# EAGLE design board5 (EAGLE 6.4)
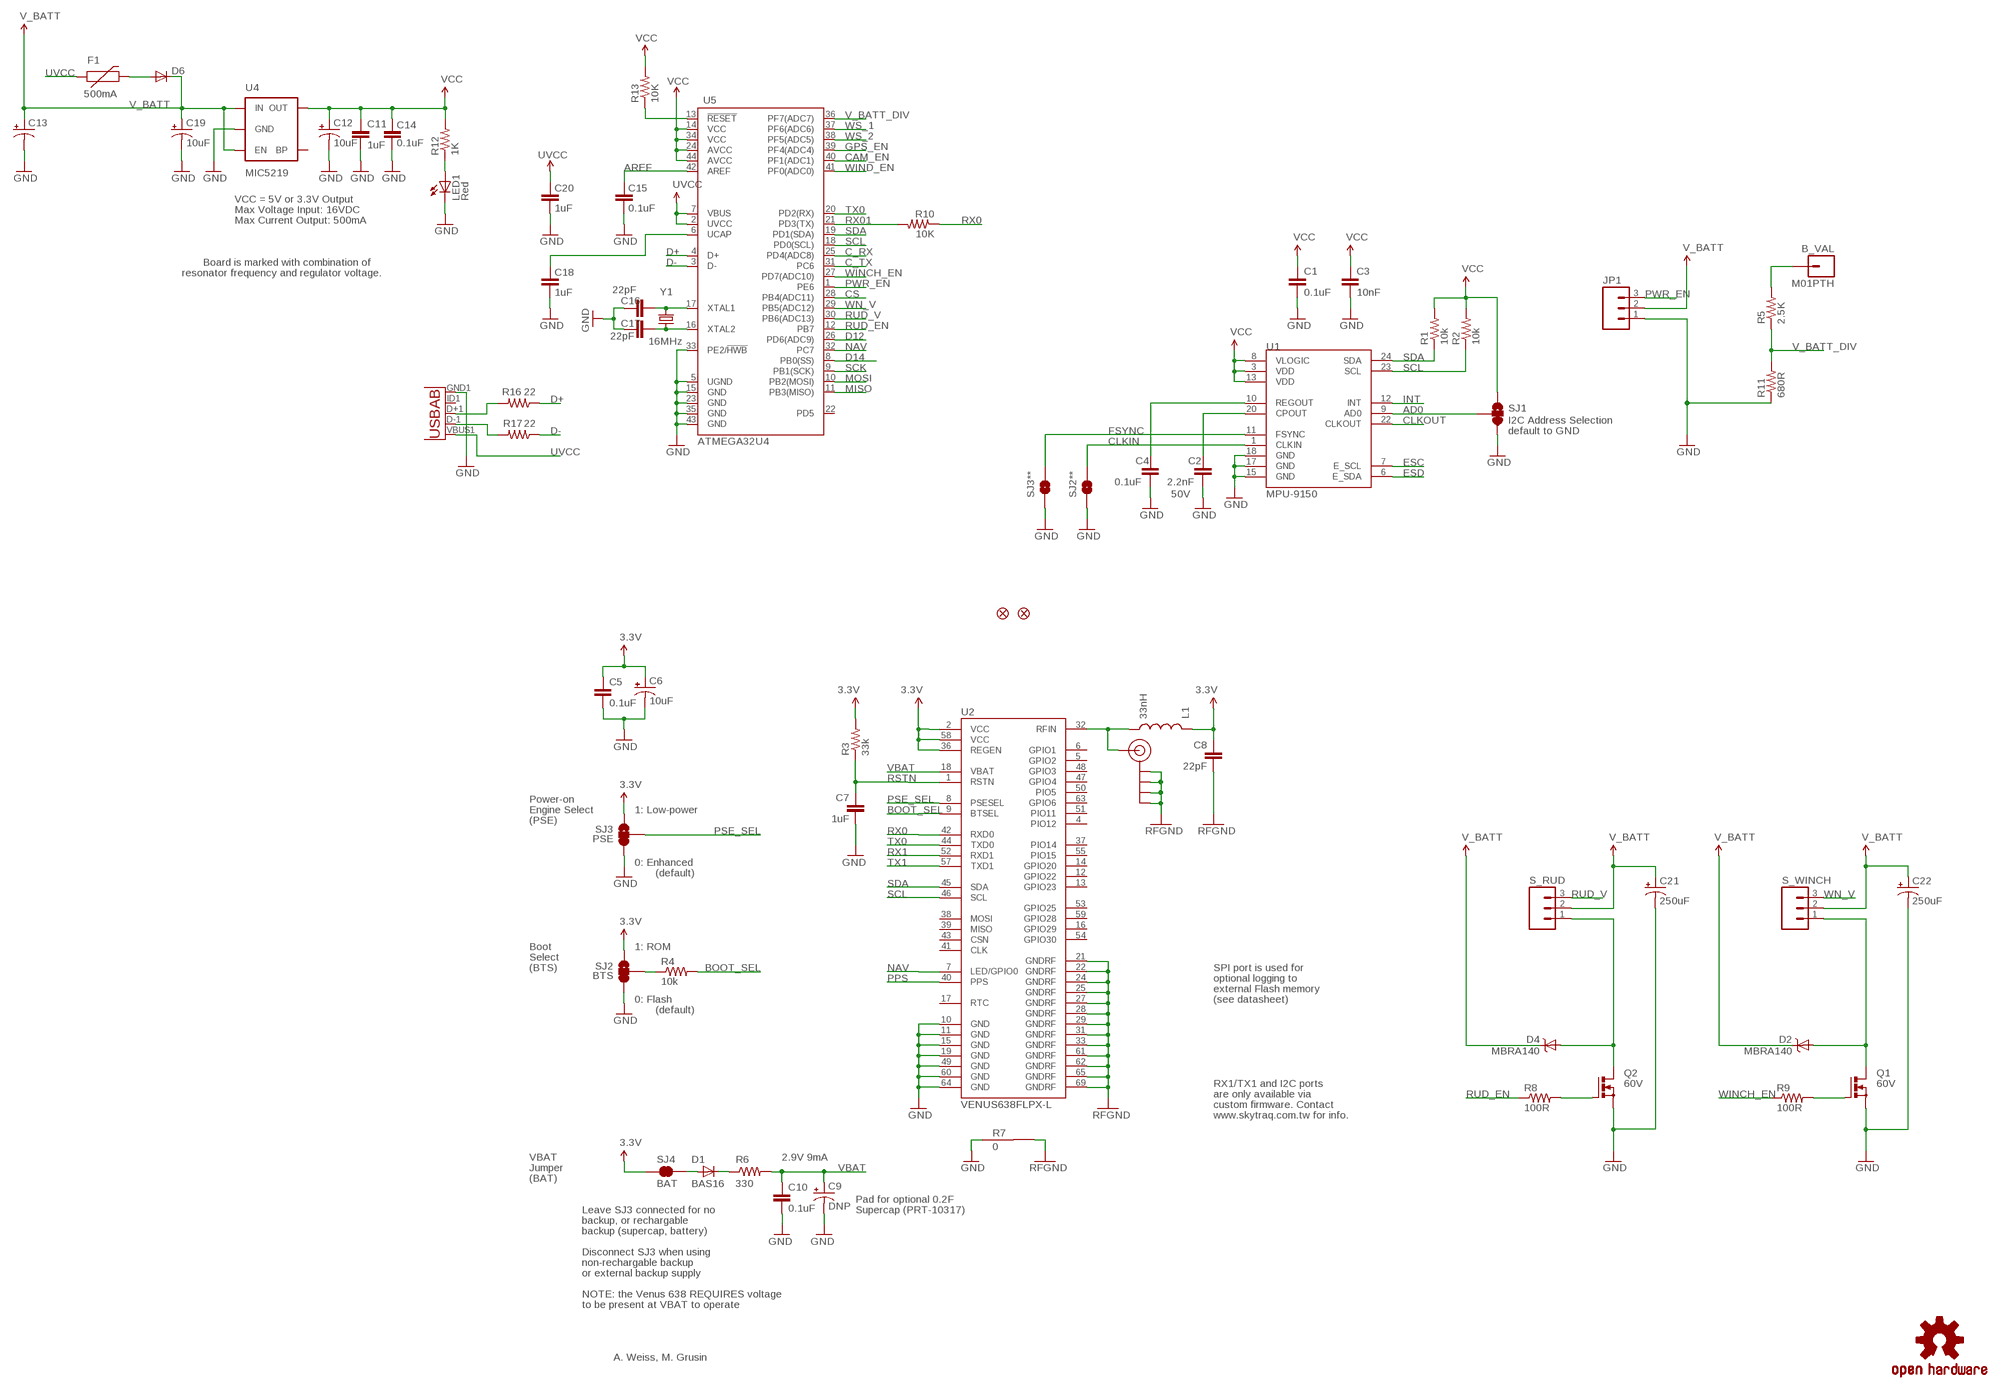
[diagram p0: schematic, sheet 1, part 1 of 2]
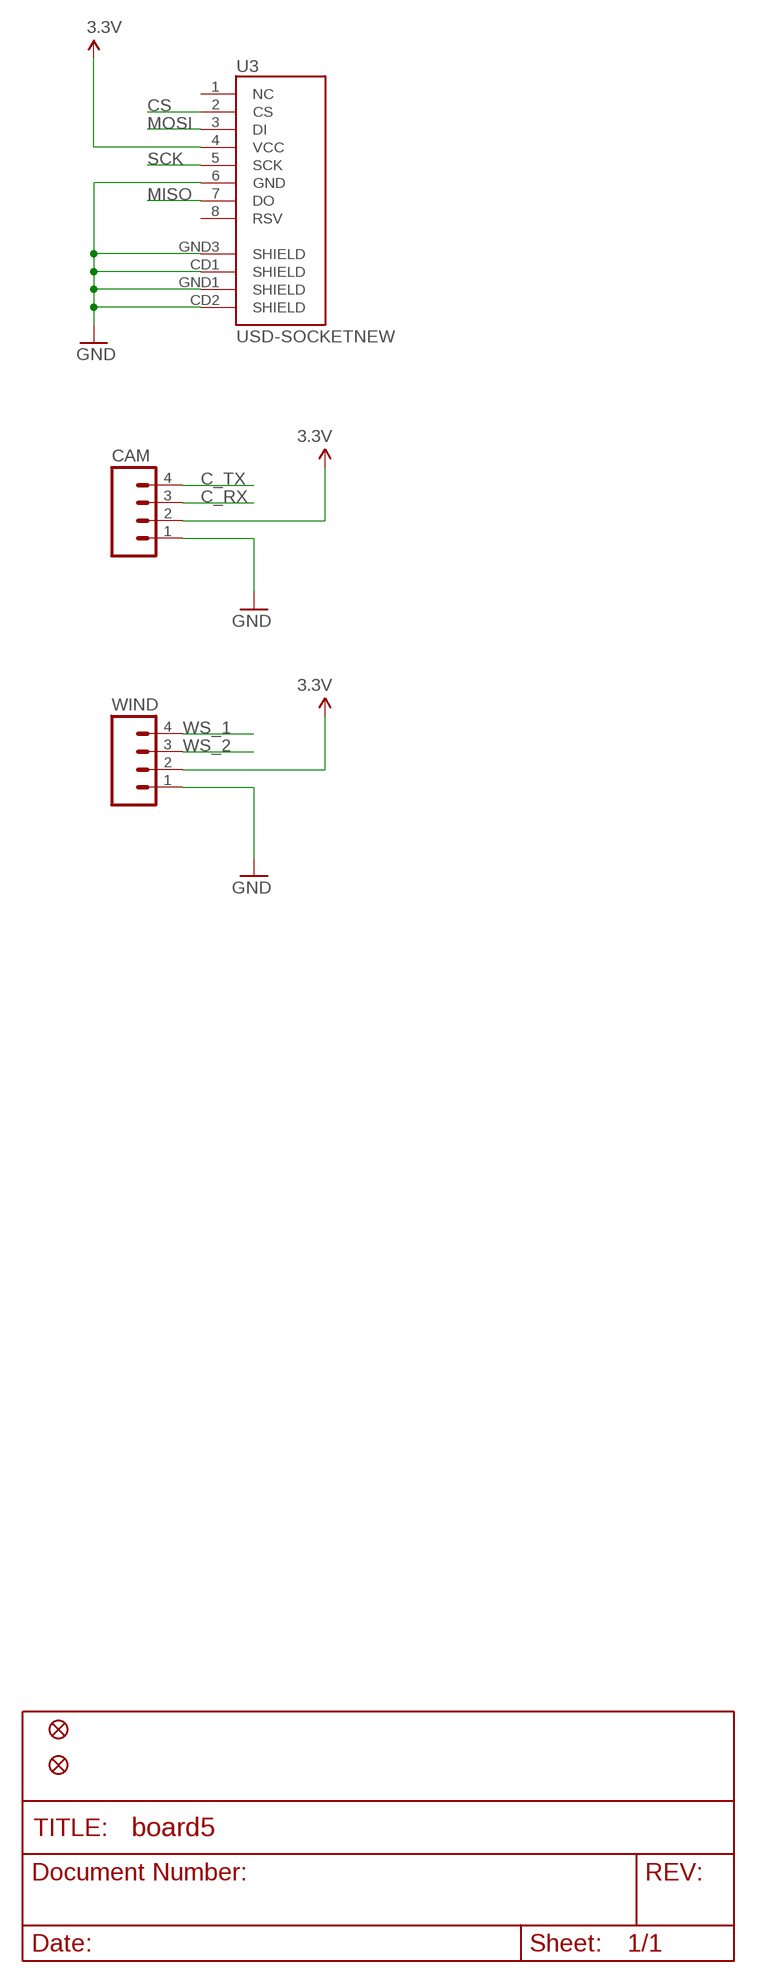
[diagram p1: schematic, sheet 1, part 2 of 2]

## Parts
B_VAL  M01PTH  [1X01]
C1  0.1uF  CAP0402-CAP  [0402-CAP]
C2  2.2nF  CAP0402-CAP  [0402-CAP]
C3  10nF  CAP0402-CAP  [0402-CAP]
C4  0.1uF  CAP0402-CAP  [0402-CAP]
C5  0.1uF  CAP0402-CAP  [0402-CAP]
C6  10uF  CAP_POL1206  [EIA3216]
C7  1uF  CAP0402-CAP  [0402-CAP]
C8  22pF  CAP0402-CAP  [0402-CAP]
C9  DNP  CAP_POLPTH4  [CPOL-RADIAL-1000UF-25V]
C10  0.1uF  CAP0402-CAP  [0402-CAP]
C11  1uF  CAP0603-CAP  [0603-CAP]
C12  10uF  CAP_POL1206  [EIA3216]
C13  CAP_POLPTH4  [CPOL-RADIAL-1000UF-25V]
C14  0.1uF  CAP0603-CAP  [0603-CAP]
C15  0.1uF  CAP0603-CAP  [0603-CAP]
C16  22pF  CAP0603-CAP  [0603-CAP]
C17  22pF  CAP0603-CAP  [0603-CAP]
C18  1uF  CAP0603-CAP  [0603-CAP]
C19  10uF  CAP_POL1206  [EIA3216]
C20  1uF  CAP0603-CAP  [0603-CAP]
C21  250uF  CAP_POLPTH4  [CPOL-RADIAL-1000UF-25V]
C22  250uF  CAP_POLPTH4  [CPOL-RADIAL-1000UF-25V]
CAM  M04PTH  [1X04]
D1  BAS16  DIODESOD  [SOD-323]
D2  MBRA140  [SMA-DIODE]
D4  MBRA140  [SMA-DIODE]
D6  DIODESOD  [SOD-323]
F1  500mA  PTCSMD  [PTC-1206]
JP1  M03SCREW  [SCREWTERMINAL-3.5MM-3]
JP3  FIDUCIALUFIDUCIAL  [MICRO-FIDUCIAL]
JP4  FIDUCIALUFIDUCIAL  [MICRO-FIDUCIAL]
JP5  SMA_EDGE  [SMA-EDGE]
JP7  FIDUCIALUFIDUCIAL  [MICRO-FIDUCIAL]
JP8  FIDUCIALUFIDUCIAL  [MICRO-FIDUCIAL]
L1  33nH  INDUCTOR0402  [C0402]
LED1  Red  LED0603  [LED-0603]
Q1  60V  PMOSFET_NTO220BV  [TO220BV]
Q2  60V  PMOSFET_NTO220BV  [TO220BV]
R1  10k  RESISTOR0603-RES  [0603-RES]
R2  10k  RESISTOR0603-RES  [0603-RES]
R3  33k  RESISTOR0402-RES  [0402-RES]
R4  10k  RESISTOR0402-RES  [0402-RES]
R5  2.5K  RESISTOR0603-RES  [0603-RES]
R6  330  RESISTOR0402-RES  [0402-RES]
R7  0  GND-JUMP  [GND-JUMP]
R8  100R  RESISTOR0603  [0603-RES]
R9  100R  RESISTOR0603  [0603-RES]
R10  10K  RESISTOR0402-RES  [0402-RES]
R11  680R  RESISTOR0603-RES  [0603-RES]
R12  1K  RESISTOR0603-RES  [0603-RES]
R13  10K  RESISTOR0603-RES  [0603-RES]
R16  22  RESISTOR0603-RES  [0603-RES]
R17  22  RESISTOR0603-RES  [0603-RES]
S_RUD  M03PTH  [1X03]
S_WINCH  M03PTH  [1X03]
SJ1  SOLDERJUMPER_2WAYPASTE2&3  [SJ_3_PASTE2&3]
SJ2  BTS  SOLDERJUMPER_2WAYPASTE2&3  [SJ_3_PASTE2&3]
SJ2**  SOLDERJUMPERTRACE  [SJ_2S-TRACE]
SJ3  PSE  SOLDERJUMPER_2WAYPASTE2&3  [SJ_3_PASTE2&3]
SJ3**  SOLDERJUMPERTRACE  [SJ_2S-TRACE]
SJ4  BAT  SOLDERJUMPERNC  [SJ_2S]
U1  MPU-9150  MPU-9150QFN-24-NP  [QFN-24-NP]
U2  VENUS638FLPX-L  [VENUS638FLPX]
U3  USD-SOCKETNEW  [MICRO-SD-SOCKET-PP]
U4  MIC5219  V_REG_LDOSMD  [SOT23-5]
U5  ATMEGA32U4  ATMEGA32U4OUTFAKES  [QFN-44-NOPAD_1:1-OUTFAKES]
U$4  OSHW-LOGOS  [OSHW-LOGO-S]
WIND  M04PTH  [1X04]
X1  USB-ABIN&OUT  [USB-AB-MICRO-SMD-V03-IN&OUT]
Y1  16MHz  CRYSTAL5X3  [CRYSTAL-SMD-5X3]

## Nets
3.3V: C1.1 C3.1 C11.1 C12.A(+) C14.2 R1.2 R2.2 R12.2 R13.2 SJ1.1 U1.3(VDD) U1.8(VLOGIC) U1.13(VDD) U3.4(VCC) U4.5(OUT) U5.14(VCC) U5.24(AVCC) U5.34(VCC) U5.44(AVCC) ; supply symbol labelled VCC
AD0: SJ1.2 U1.9(AD0)
ANT: JP5.SIG(SIGNAL) L1.2 U2.32(RFIN)
AREF: C15.2 U5.42(AREF)
BOOT_SEL: R4.2 U2.9(BTSEL)
C_RX: CAM.3 U5.25(PD4(ADC8))
C_TX: CAM.4 U5.31(PC6)
CAM_EN: CAM.2 U5.40(PF1(ADC1)) ; supply symbol labelled 3.3V
CLKIN: SJ2**.2 U1.1(CLKIN)
CLKOUT: U1.22(CLKOUT)
CS: U3.2(CS) U5.28(PB4(ADC11))
D12: U5.26(PD6(ADC9))
D14: U5.8(PB0(SS))
D+: R16.1 U5.4(D+)
D-: R17.1 U5.3(D-)
ESC: U1.7(E_SCL)
ESD: U1.6(E_SDA)
FSYNC: SJ3**.2 U1.11(FSYNC)
GND: C1.2 C2.2 C3.2 C4.2 C5.2 C6.C(-) C7.2 C9.2(-) C10.2 C11.2 C12.C(-) C13.2(-) C14.1 C15.1 C16.2 C17.2 C18.1 C19.C(-) C20.1 C21.2(-) C22.2(-) CAM.1 JP1.1 LED1.C Q1.S Q2.S R7.1 R11.1 SJ1.3 SJ2**.1 SJ2.3 SJ3**.1 SJ3.3 U1.15(GND) U1.17(GND) U1.18(GND) U2.10(GND) U2.11(GND) U2.15(GND) U2.19(GND) U2.49(GND) U2.60(GND) U2.64(GND) U3.6(GND) U3.CD1(SHIELD) U3.CD2(SHIELD) U3.GND1(SHIELD) U3.GND3(SHIELD) U4.2(GND) U5.5(UGND) U5.15(GND) U5.23(GND) U5.33(PE2/!HWB) U5.35(GND) U5.43(GND) WIND.1 X1.GND1(GND)
GPS_EN: C5.1 C6.A(+) C8.1 L1.1 R3.2 SJ2.1 SJ3.1 SJ4.1 U2.2(VCC) U2.36(REGEN) U2.58(VCC) U5.39(PF4(ADC4)) ; supply symbol labelled 3.3V
INT: U1.12(INT)
MISO: U3.7(DO) U5.11(PB3(MISO))
MOSI: U3.3(DI) U5.10(PB2(MOSI))
N$1: C2.1 U1.20(CPOUT)
N$2: C4.1 U1.10(REGOUT)
N$3: B_VAL.1 R5.2
N$4: R4.1 SJ2.2
N$5: D1.1(C) R6.1
N$6: D1.2(A) SJ4.2
N$7: Q2.G R8.2
N$8: D2.A Q1.D S_WINCH.1
N$9: D4.A Q2.D S_RUD.1
N$10: Q1.G R9.2
N$11: C17.1 U5.16(XTAL2) Y1.1
N$12: C16.1 U5.17(XTAL1) Y1.3
N$13: C18.2 U5.6(UCAP)
N$14: R17.2 X1.D-1(D-)
N$15: R16.2 X1.D+1(D+)
N$16: D6.2(A) F1.2
N$38: LED1.A R12.1
NAV: U2.7(LED/GPIO0) U5.32(PC7)
PPS: U2.40(PPS)
PSE_SEL: SJ3.2 U2.8(PSESEL)
PWR_EN: JP1.3 U5.1(PE6)
RESET: R13.1 U5.13(!RESET)
RFGND: C8.2 JP5.GND@0(GND) JP5.GND@1(GND) JP5.GND@2(GND) JP5.GND@3(GND) R7.2 U2.21(GNDRF) U2.22(GNDRF) U2.24(GNDRF) U2.25(GNDRF) U2.27(GNDRF) U2.28(GNDRF) U2.29(GNDRF) U2.31(GNDRF) U2.33(GNDRF) U2.61(GNDRF) U2.62(GNDRF) U2.65(GNDRF) U2.69(GNDRF)
RSTN: C7.1 R3.1 U2.1(RSTN)
RUD_EN: R8.1 U5.12(PB7)
RUD_V: S_RUD.3 U5.30(PB6(ADC13))
RX0: R10.1 U2.42(RXD0)
RX1: U2.52(RXD1)
RX01: R10.2 U5.21(PD3(TX))
SCK: U3.5(SCK) U5.9(PB1(SCK))
SCL: R2.1 U1.23(SCL) U2.46(SCL) U5.18(PD0(SCL))
SDA: R1.1 U1.24(SDA) U2.45(SDA) U5.19(PD1(SDA))
TX0: U2.44(TXD0) U5.20(PD2(RX))
TX1: U2.57(TXD1)
UVCC: C20.2 F1.1 U5.2(UVCC) U5.7(VBUS) X1.VBUS1(VBUS)
V_BATT: C13.1(+) C19.A(+) C21.1(+) C22.1(+) D2.C D4.C D6.1(C) JP1.2 S_RUD.2 S_WINCH.2 U4.1(IN) U4.3(EN)
V_BATT_DIV: R5.1 R11.2 U5.36(PF7(ADC7))
VBAT: C9.1(+) C10.1 R6.2 U2.18(VBAT)
WINCH_EN: R9.1 U5.27(PD7(ADC10))
WIND_EN: U5.41(PF0(ADC0)) WIND.2 ; supply symbol labelled 3.3V
WN_V: S_WINCH.3 U5.29(PB5(ADC12))
WS_1: U5.37(PF6(ADC6)) WIND.4
WS_2: U5.38(PF5(ADC5)) WIND.3
Unconnected: U2.4(PIO12) U2.5(GPIO2) U2.6(GPIO1) U2.12(GPIO22) U2.13(GPIO23) U2.14(GPIO20) U2.16(GPIO29) U2.17(RTC) U2.37(PIO14) U2.38(MOSI) U2.39(MISO) U2.41(CLK) U2.43(CSN) U2.47(GPIO4) U2.48(GPIO3) U2.50(PIO5) U2.51(PIO11) U2.53(GPIO25) U2.54(GPIO30) U2.55(PIO15) U2.59(GPIO28) U2.63(GPIO6) U3.1(NC) U3.8(RSV) U4.4(BP) U5.22(PD5) X1.ID1(USBID)

## Notes on the sheet
- VCC = 5V or 3.3V Output
- Max Voltage Input: 16VDC
- Max Current Output: 500mA
- Board is marked with combination of
- resonator frequency and regulator voltage.
- I2C Address Selection
- default to GND
- 50V
- Power-on
- Engine Select | 1: Low-power
- (PSE)
- RFGND | RFGND
- 0: Enhanced
- (default)
- Boot | 1: ROM
- Select
- (BTS) | SPI port is used for
- optional logging to
- external Flash memory
- 0: Flash | (see datasheet)
- (default)
- RX1/TX1 and I2C ports
- are only available via
- custom firmware. Contact
- RFGND | www.skytraq.com.tw for info.
- VBAT | 2.9V 9mA
- Jumper | RFGND
- (BAT)
- Pad for optional 0.2F
- Leave SJ3 connected for no | Supercap (PRT-10317)
- backup, or rechargable
- backup (supercap, battery)
- Disconnect SJ3 when using
- non-rechargable backup
- or external backup supply
- NOTE: the Venus 638 REQUIRES voltage
- to be present at VBAT to operate
- A. Weiss, M. Grusin

## Library data of the parts
B_VAL = SparkFun-Connectors:M01: Header 1 Standard 1-pin 0.1" header. Use with straight break away headers (SKU : PRT-00116), right angle break away headers (PRT-00553), swiss pins (PRT-00743), machine pins (PRT-00117), and female headers (PRT-00115).
C1-C4 = SparkFun-Passives:CAP: Capacitor Standard 0603 ceramic capacitor, and 0.1" leaded capacitor.
C5 C7 C8 C10 C11 C14-C18 C20 = SparkFun:CAP: Capacitor Standard 0603 ceramic capacitor, and 0.1" leaded capacitor.
C6 C9 C12 C19 = SparkFun:CAP_POL: Capacitor Polarized These are standard SMD and PTH capacitors. Normally 10uF, 47uF, and 100uF in electrolytic and tantalum varieties. Always verify the external diameter of the through hole cap, it varies with capacity, voltage, and manufacturer. The EIA devices should be standard.
C13 C21 C22 = SparkFun-Passives:CAP_POL: Capacitor Polarized These are standard SMD and PTH capacitors. Normally 10uF, 47uF, and 100uF in electrolytic and tantalum varieties. Always verify the external diameter of the through hole cap, it varies with capacity, voltage, and manufacturer. The EIA devices should be standard.
CAM WIND = SparkFun-Connectors:M04: Header 4 Standard 4-pin 0.1" header. Use with straight break away headers (SKU : PRT-00116), right angle break away headers (PRT-00553), swiss pins (PRT-00743), machine pins (PRT-00117), and female headers (PRT-00115). Molex polarized connector foot print use with SKU : PRT-08231 with associated crimp pins and housings. 1MM SMD Version SKU: PRT-10208
D1 D6 = SparkFun:DIODE: Diode These are standard reverse protection diodes and small signal diodes. SMA package can handle up to about 1A. SOD-323 can handle about 200mA. What the SOD-323 package when ordering, there are some mfgs out there that are 5-pin packages.
D2 D4 = SparkFun-DiscreteSemi:MBRA140: 40V, 1A Schottky rectifier SMA/DO-214AC package DIO-08053; PROD_ID: DIO-08053
F1 = SparkFun:PTC: Resettable Fuse PTC Resettable Fuse. Spark Fun Electronics SKU : COM-08357
JP1 S_RUD S_WINCH = SparkFun-Connectors:M03: Header 3 Standard 3-pin 0.1" header. Use with straight break away headers (SKU : PRT-00116), right angle break away headers (PRT-00553), swiss pins (PRT-00743), machine pins (PRT-00117), and female headers (PRT-00115). Molex polarized connector foot print use with SKU : PRT-08232 with associated crimp pins and housings.
JP3 JP4 JP7 JP8 = SparkFun:FIDUCIAL: Fiducial Alignment Points Various fiducial points for machine vision alignment.
JP5 = SparkFun:SMA_EDGE: SMA Antenna Connector End launch SMA connector. The paste layer has been removed so that the connector can be hand soldered onto the board after reflow.
L1 = SparkFun:INDUCTOR: Inductors Basic Inductor/Choke - 0603 and 1206. Footprints are not proven and vary greatly between part numbers.
LED1 = SparkFun:LED: LEDs Standard schematic elements and footprints for 5mm, 3mm, 1206, and 0603 sized LEDs. 5mm - Spark Fun Electronics SKU : COM-00529 (and others)
Q1 Q2 = transistor-power:PMOSFET_N: Power MOSFET N-Channel
R1 R2 R5 R11 = SparkFun-Passives:RESISTOR: Resistor Basic schematic elements and footprints for 0603, 1206, and PTH resistors.
R3 R4 R6 R10 R12 R13 R16 R17 = SparkFun:RESISTOR: Resistor Basic schematic elements and footprints for 0603, 1206, and PTH resistors.
R7 = mike-temp:GND-JUMP: Zero-Ohm trace for connecting different ground planes at a single point.
R8 R9 = SparkFun-Resistors:RESISTOR: Resistor Basic schematic elements and footprints for 0603, 1206, and PTH resistors.
SJ1 = SparkFun-Passives:SOLDERJUMPER_2WAY: Solder Jumper 2 way solder jumper
SJ2 SJ3 = SparkFun:SOLDERJUMPER_2WAY: Solder Jumper 2 way solder jumper
SJ2** SJ3** = SparkFun-Passives:SOLDERJUMPER: Solder Jumper Standard SMD solder jumper. Used to automate production. Two varients : Normally Open and Normally Closed are the same, but have different paste layers. NC will have a large amount of paste and should jumper during reflow.
SJ4 = SparkFun:SOLDERJUMPER: Solder Jumper Standard SMD solder jumper. Used to automate production. Two varients : Normally Open and Normally Closed are the same, but have different paste layers. NC will have a large amount of paste and should jumper during reflow.
U1 = SparkFun-Sensors:MPU-9150: 9DOF (3mag, 3accel, 3rotat). I2C interface.
U2 = mike-temp:VENUS638FLPX-L: Venus638FLPX-L GPS Receiver Venus638FLPx is a high performance, low cost, single chip GPS receiver targeting mobile consumer and cellular handset applications. It offers very low power consumption, high sensitivity, and best in class signal acquisition and time-to-first-fix performance. Venus638FLPx contains all the necessary components of a complete GPS receiver, includes 1.2dB cascaded system NF RF front-end, GPS baseband signal processor, 0.5ppm TCXO, 32.768kHz RTC crystal, RTC LDO regulator, and passive components. It requires very low external component count and takes up only 100mm2 PCB footprint. Dedicated massive-correlator signal parameter search engine within the baseband enables rapid search of all the available satellites and acquisition of very weak signal. An advanced track engine allows weak signal tracking and positioning in harsh environments such as urban canyons and under deep foliage. The self-contained architecture keeps GPS processing off the host and allows integration into applications with very little resource. FEATURES 20Hz update rate -148dBm cold start sensitivity -165dBm tracking sensitivity 29 second cold start TTFF 3.5 second TTFF with AGPS 1 second hot start 2.5m accuracy Multipath detection and suppression Jamming detection and mitigation SBAS (WAAS / EGNOS) support 7-day extended ephemeris AGPS 67mW full power navigation Works directly with active or passive antenna Internal flash for optional 75K point data logging Supports external SPI flash memory data logging Complete receiver in 10mm x 10mm x 1.3mm size Contains LNA, SAW Filter, TCXO, RTC Xtal, LDO Pb-free RoHS compliant
U3 = SparkFun:USD-SOCKET: microSD Socket Push-push type uSD socket. Schematic element and footprint production proven. Spark Fun Electronics SKU : PRT-00127. tDoc lines correctly indicate media card edge positions when inserting (unlocked, locked, depressed).
U4 = SparkFun:V_REG_LDO: Voltage Regulator LDO Standard 150mA LDO voltage regulator in SOT-23 layout. Micrel part MIC5205. BP (by-pass) pin is used to lower output noise with 470pF cap.
U5 = Testing:ATMEGA32U4: Atmel 44-pin 8-bit Microcontroller with 32KBytes of ISP Flash and USB Controller
U$4 = SparkFun:OSHW-LOGO: Open Source Hardware Logo This logo indicates the piece of hardware it is found on incorporates a OSHW license and/or adheres to the definition of open source hardware found here: http://freedomdefined.org/OSHW
X1 = Testing:USB-AB: This is a USB AB connector that is compatible with USB OTG. i.e. this connector can serve as a host or device
Y1 = SparkFun:CRYSTAL: Crystals Various standard crystals. Proven footprints. Spark Fun Electronics SKU : COM-00534

## Net classes
0 default: width 0.203 mm

## Board
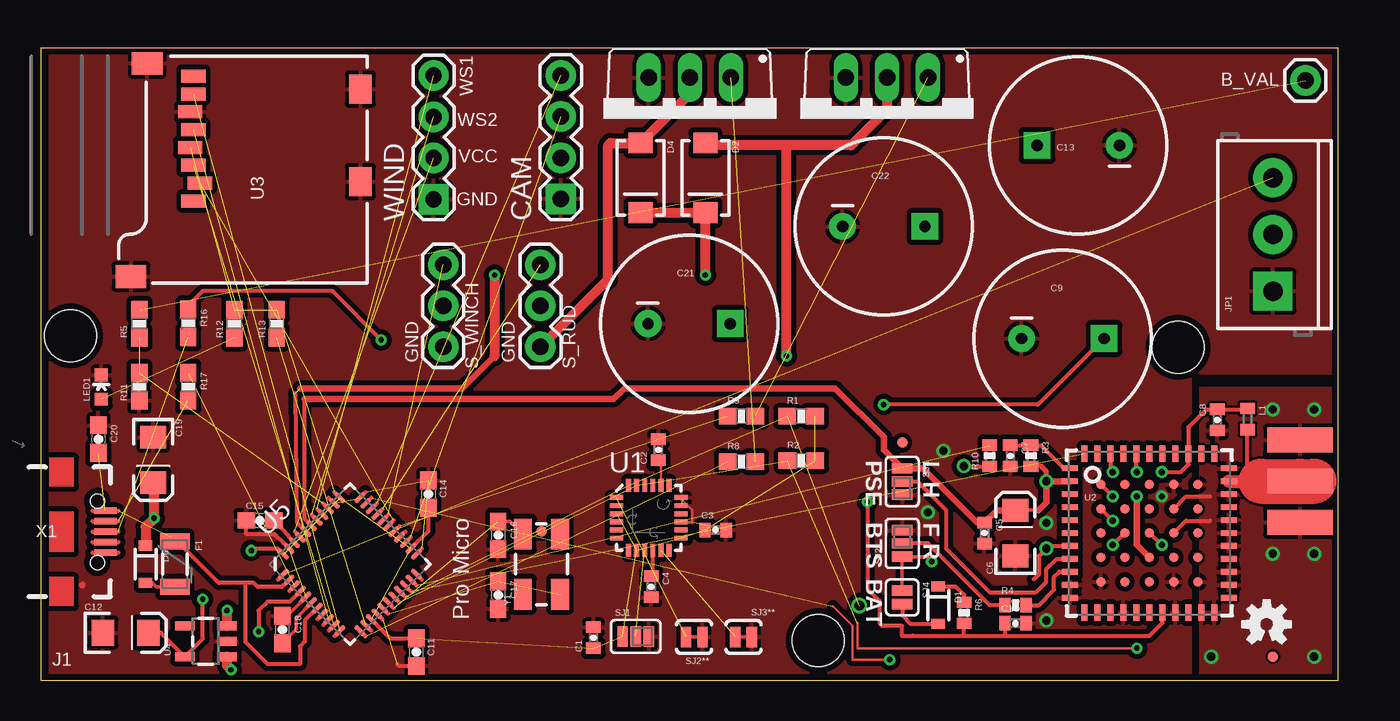
[diagram p2: board, top side]
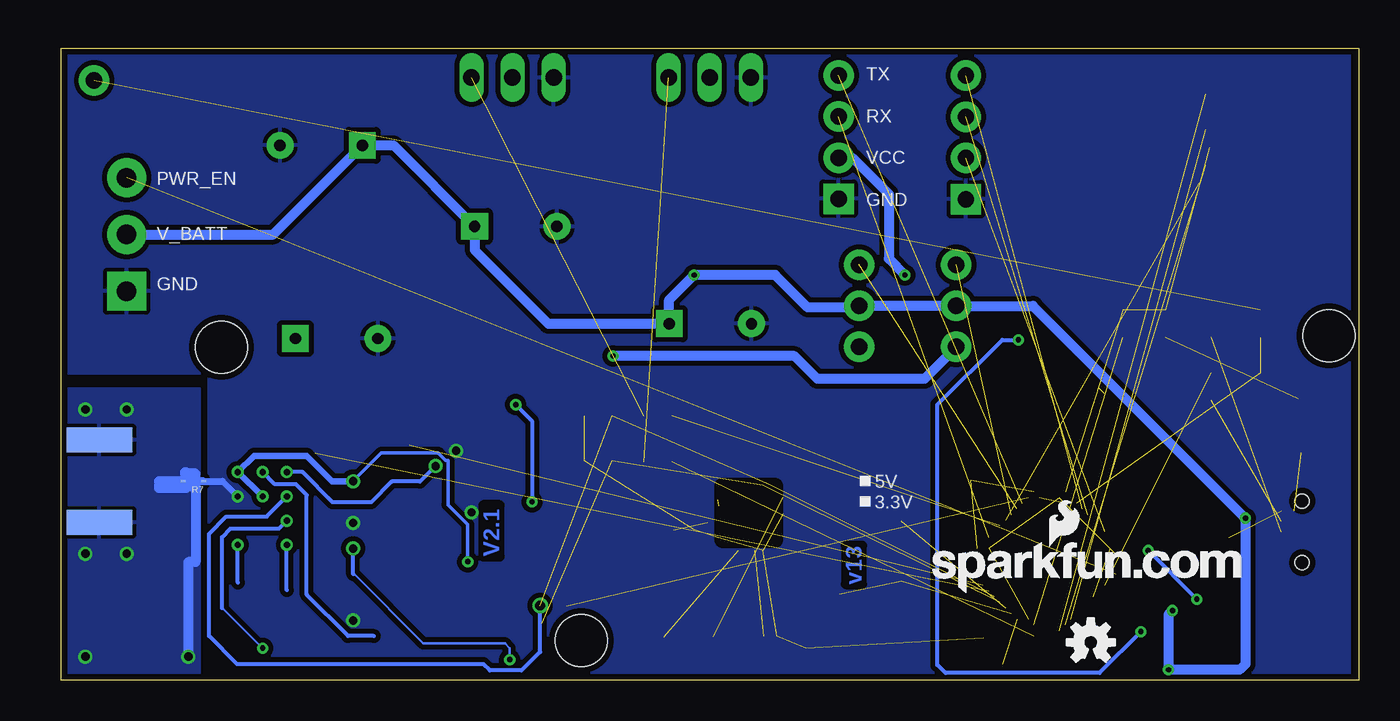
[diagram p3: board, bottom side, seen from below]

Size 80.03 x 38.98 mm. Coordinates in mm from the lower left corner, seen from the top.
Outline: 0,0 80.03,0 80.03,38.98 0,38.98 0,0
Copper layers (1*16): Top 0.0356mm / dielectric 1.5011mm / Bottom 0.0356mm
Design rules "LaenPCBOrder *": minimum track width 6mil, minimum drill 13mil, track to track 6mil, track to pad 6mil, pad to pad 6mil, via to via 6mil, smd to smd 6mil, copper to edge 15mil, drill to drill 6mil, minimum pad ring 7mil, minimum via ring 7mil, stop-mask expansion 3mil, vias tented up to drill 15mil, thermal gap 10mil
Holes 3.2 mm at 1.84,21.25 47.96,2.45 70.16,20.54
tRestrict: area 23.3,7.4 to 23.5,7.6; area 19.4,11.4 to 19.5,11.4; area 15.5,3.7 to 22.8,10.8; area 36,8.7 to 39,11.3
bRestrict: area 36,8.7 to 39.2,12

### Footprints (pad centres in the part's own frame; a part is rotated, then mirrored left to right if it is on the bottom)
1X01 = drill 1.016 pad 1.88: 1 0,0
0402-CAP = smd 0.7 x 0.9: 1 -0.65,0; 2 0.65,0
EIA3216 = smd 1.4 x 1.6: A 1.4,0; C -1.4,0
CPOL-RADIAL-1000UF-25V = drill 0.7 pad 1.651 square: 1 2.54,0 | drill 0.7 pad 1.651: 2 -2.54,0
0603-CAP = smd 1.1 x 1: 1 -0.85,0; 2 0.85,0
1X04 = drill 1.016 pad 1.88 square: 1 0,0 | drill 1.016 pad 1.88: 2 2.54,0; 3 5.08,0; 4 7.62,0
SOD-323 = smd 0.63 x 0.83: 1 -1.15,0; 2 1.15,0
SMA-DIODE = smd 1.27 x 1.47: A -2.15,0; C 2.15,0
PTC-1206 = smd 1 x 1.8: 1 -1.4,0; 2 1.4,0
SCREWTERMINAL-3.5MM-3 = drill 1.2 pad 2.413 square: 1 0,0 | drill 1.2 pad 2.413: 2 3.5,0; 3 7,0
MICRO-FIDUCIAL = smd 0.635 x 0.635: 1 0,0
SMA-EDGE = smd 1.524 x 4.064: GND@0 0,0; GND@1 5.08,0; SIG 2.54,0 | smd 1.524 x 4.064 bottom: GND@2 0,0; GND@3 5.08,0
C0402 = smd 0.7 x 0.9: 1 -0.65,0; 2 0.65,0
LED-0603 = smd 0.8 x 0.8: A 0,-0.75; C 0,0.75
TO220BV = drill 1.016 long: D 0,-2.54; G -2.54,-2.54; S 2.54,-2.54
0603-RES = smd 1.1 x 1: 1 -0.85,0; 2 0.85,0
0402-RES = smd 0.7 x 0.9: 1 -0.65,0; 2 0.65,0
GND-JUMP = smd 0.305 x 0.152: 1 -0.635,0; 2 0.635,0
1X03 = drill 1.016 pad 1.88: 1 0,0; 2 2.54,0; 3 5.08,0
SJ_3_PASTE2&3 = smd 0.635 x 1.27: 1 -0.813,0; 2 0,0; 3 0.813,0
SJ_2S-TRACE = smd 0.635 x 1.27: 1 -0.508,0; 2 0.508,0
SJ_2S = smd 0.635 x 1.27: 1 -0.412,0; 2 0.412,0
QFN-24-NP = smd 0.8 x 0.3: 1 -2,1.25; 2 -2,0.75; 3 -2,0.25; 4 -2,-0.25; 5 -2,-0.75; 6 -2,-1.25; 13 2,-1.25; 14 2,-0.75; 15 2,-0.25; 16 2,0.25; 17 2,0.75; 18 2,1.25 | smd 0.3 x 0.8: 7 -1.25,-2; 8 -0.75,-2; 9 -0.25,-2; 10 0.25,-2; 11 0.75,-2; 12 1.25,-2; 19 1.25,2; 20 0.75,2; 21 0.25,2; 22 -0.25,2; 23 -0.75,2; 24 -1.25,2
VENUS638FLPX = smd 1 x 0.36: 1 -4.9,4; 2 -4.9,3.2; 3 -4.9,2.4; 4 -4.9,1.6; 5 -4.9,0.8; 6 -4.9,0; 7 -4.9,-0.8; 8 -4.9,-1.6; 9 -4.9,-2.4; 10 -4.9,-3.2; 11 -4.9,-4; 23 4.9,-4; 24 4.9,-3.2; 25 4.9,-2.4; 26 4.9,-1.6; 27 4.9,-0.8; 28 4.9,0; 29 4.9,0.8; 30 4.9,1.6; 31 4.9,2.4; 32 4.9,3.2; 33 4.9,4 | smd 0.36 x 1: 12 -4,-4.9; 13 -3.2,-4.9; 14 -2.4,-4.9; 15 -1.6,-4.9; 16 -0.8,-4.9; 17 0,-4.9; 18 0.8,-4.9; 19 1.6,-4.9; 20 2.4,-4.9; 21 3.2,-4.9; 22 4,-4.9; 34 4,4.9; 35 3.2,4.9; 36 2.4,4.9; 37 1.6,4.9; 38 0.8,4.9; 39 0,4.9; 40 -0.8,4.9; 41 -1.6,4.9; 42 -2.4,4.9; 43 -3.2,4.9; 44 -4,4.9 | smd 0.6 x 0.6: 45 -3,3; 46 -3,1.5; 47 -3,0; 48 -3,-1.5; 49 -3,-3; 50 -1.5,3; 51 -1.5,1.5; 52 -1.5,0; 53 -1.5,-1.5; 54 -1.5,-3; 55 0,3; 56 0,1.5; 57 0,0; 58 0,-1.5; 59 0,-3; 60 1.5,3; 61 1.5,1.5; 62 1.5,0; 63 1.5,-1.5; 64 1.5,-3; 65 3,3; 66 3,1.5; 67 3,0; 68 3,-1.5; 69 3,-3
MICRO-SD-SOCKET-PP = smd 0.8 x 1.5: 1 -8.94,10.7; 2 -7.84,10.3; 3 -6.74,10.7; 4 -5.64,10.9; 5 -4.54,10.7; 6 -3.44,10.9; 7 -2.34,10.7; 8 -1.24,10.7 | smd 1.8 x 1.4: CD1 -2.05,0.4; CD2 -7.75,0.4 | smd 1.4 x 1.9: GND1 -13.6,14.55; GND3 -0.45,13.55
SOT23-5 = smd 0.55 x 1.2: 1 -0.95,-1.3; 2 0,-1.3; 3 0.95,-1.3; 4 0.95,1.3; 5 -0.95,1.3
QFN-44-NOPAD_1:1-OUTFAKES = smd 0.8 x 0.3: 1 -3.337,2.465; 2 -3.337,1.972; 3 -3.337,1.479; 4 -3.337,0.986; 5 -3.337,0.493; 6 -3.337,0; 7 -3.337,-0.493; 8 -3.337,-0.986; 9 -3.337,-1.479; 10 -3.337,-1.972; 11 -3.337,-2.465; 23 3.337,-2.465; 24 3.337,-1.972; 25 3.337,-1.479; 26 3.337,-0.986; 27 3.337,-0.493; 28 3.337,0; 29 3.337,0.493; 30 3.337,0.986; 31 3.337,1.479; 32 3.337,1.972; 33 3.337,2.465 | smd 0.3 x 0.8: 12 -2.465,-3.337; 13 -1.972,-3.337; 14 -1.479,-3.337; 15 -0.986,-3.337; 16 -0.493,-3.337; 17 0,-3.337; 18 0.493,-3.337; 19 0.986,-3.337; 20 1.479,-3.337; 21 1.972,-3.337; 22 2.465,-3.337; 34 2.465,3.337; 35 1.972,3.337; 36 1.479,3.337; 37 0.986,3.337; 38 0.493,3.337; 39 0,3.337; 40 -0.493,3.337; 41 -0.986,3.337; 42 -1.479,3.337; 43 -1.972,3.337; 44 -2.465,3.337
USB-AB-MICRO-SMD-V03-IN&OUT = smd 1.4 x 0.4: D+1 2.7,0; D-1 2.7,0.65; GND1 2.7,-1.3; ID1 2.7,-0.65; VBUS1 2.7,1.3 | hole 0.85: 2.2,1.9; 2.2,-1.9
CRYSTAL-SMD-5X3 = smd 1.9 x 1.1: 1 -1.85,-1.15; 2 1.85,-1.15; 3 1.85,1.15; 4 -1.85,1.15

### Placement (x,y rotation side)
B_VAL  78,37 0 top
C1  34.1,2.63 90 top
C2  38.1,14.22 90 top
C3  41.63,9.27 0 top
C4  37.66,5.77 270 top
C5  58.22,9.08 270 top
C6  60.12,9.08 90 top
C7  59.81,13.84 270 top
C8  72.57,16.07 270 top
C9  63.05,21.08 0 top
C10  60.12,3.52 0 top
C11  23.18,1.73 270 top
C12  5.25,2.94 0 top
C13  64,33 180 top
C14  23.92,11.48 270 top
C15  13.54,9.86 0 top
C16  28.22,8.94 270 top
C17  28.22,5.25 270 top
C18  14.91,3.12 270 top
C19  6.95,13.59 270 top
C20  3.57,14.88 270 top
C21  40,22 0 top
C22  52,28 0 top
CAM  32.09,29.7 90 top
D1  55.36,4.63 270 top
D2  41,31 270 top
D4  37,31 270 top
D6  6.48,7.16 270 top
F1  8.29,7.16 270 top
JP1  76,24 90 top
JP3  30.89,9.19 90 top
JP4  3.84,2.59 90 top
JP5  77.68,9.74 90 top
JP7  76,1.46 0 top
JP8  53.14,14.67 0 top
L1  74.44,16.12 270 top
LED1  3.74,18.09 0 top
Q1  52.2,34.64 180 top
Q2  40.04,34.64 180 top
R1  46.9,16.29 0 top
R2  46.92,13.54 0 top
R3  61.08,13.84 270 top
R4  60.12,4.63 0 top
R5  6.1,22 90 top
R6  56.95,4.16 270 top
R7  71.87,12.28 180 bottom
R8  43.23,13.48 0 top
R9  43.23,16.29 0 top
R10  58.54,13.84 90 top
R11  6.1,18.1 90 top
R12  11.95,21.99 90 top
R13  14.56,22 90 top
R16  9.11,22.02 270 top
R17  9.11,18.12 270 top
S_RUD  30.83,20.56 90 top
S_WINCH  24.83,20.56 90 top
SJ1  36.7,2.7 0 top
SJ2  53.14,8.45 90 top
SJ2**  40.31,2.67 180 top
SJ3  53.14,12.26 270 top
SJ3**  43.36,2.67 180 top
SJ4  53.14,5.11 270 top
U1  37.51,10.02 0 top
U2  68.38,9.08 0 top
U3  20.13,38.51 90 top
U4  10.2,2.41 90 top
U5  19.08,7.16 45 top
U$3  OSHW-LOGOS  [OSHW-LOGO-S]  16.54,2.33 0 bottom
U$4  75.61,3.45 0 top
U$11  LOGO-SFENEW  [SFE-NEW-WEBLOGO]  26.32,5.38 0 bottom
WIND  24.24,29.68 90 top
X1  1.3,9.16 0 top
Y1  30.89,7.16 90 top

### Tracks (layer width: path | path; a pad name or v marks a point on that pad's centre or on a via)
3.3V  (via drill 0.33)  (14 unrouted)
  Top 0.254: U5.24 23.92,9.21 C14.2 | C12.A 7.41,2.94 U4.5 10,2.56 v10,5 | v13,8 13.12,8.12 14.63,8.12 | U5.14 21.57,2.58 C11.1
  Bottom 0.254: v10,5 v13,8
AD0  (1 unrouted)
ANT
  Top 0.254: L1.2 74.44,12.57 74.73,12.28 | JP5.SIG
  Top 0.813: U2.32 74.73,12.28 75.26,12.28
  Top 2.769: 78.54,12.28 JP5.SIG 75.26,12.28
AREF
  Top 0.254: 15.33,8.82 15.33,8.88 C15.2
BOOT_SEL
  Top 0.254: U2.9 62.82,6.69 62.51,6.38 62.51,5.59 61.55,4.63 R4.2
C_RX  (1 unrouted)
C_TX  (1 unrouted)
CAM_EN  (via drill 0.33)  (1 unrouted)
  Top 0.254: 15.7,17.7 15.8,9.74 16.02,9.52
  Top 0.406: 16,18 26,18 28,20
  Top 0.61: v28,25 28,20
  Bottom 0.61: CAM.2 31.24,32.24 29,30 29,26 v28,25
CLKIN  (1 unrouted)
CS  (1 unrouted)
D+  (via drill 0.33)
  Top 0.254: U5.4 15.38,4.85 14,4.85 13.45,4.3 v13.45,3 | v21,21 18,24 10,24 9.11,23.11 R16.1
  Bottom 0.254: v13.45,3 16,0.45 25.5,0.45 26,0.95 26,17 22,21 v21,21
D-  (1 unrouted)
FSYNC  (1 unrouted)
GND  (via drill 0.38, 0.51)  (7 unrouted)
  Top 0.152: U1.15 39.57,9.75 40.18,9.75 40.18,10.52 39.57,11.12 U1.18
  Top 0.203: 16.04,4.81 15.2,3.97 C18.1
  Top 0.254: 22,1 22.12,0.88 C11.2 | 14.98,8.47 14.45,9 12.7,9 12.69,9.01 C15.1
  Top 0.406: 2.57,5.86 2.57,5.89
  Bottom 0.406: 70.08,12.28 U2.60 v69.14,11.34
  Bottom 0.445: R7.1 70.08,12.28
  other vias: 54.73,10.35 62.03,9.71 62.03,3.68 55.68,14.16
  pour Bottom (isolate 0.305): 0.6,38.97 80,39 80,18.97 70.92,18.97 70.92,0.19 0.6,0.19
  pour Top (isolate 0.305): 0.6,38.97 80,39 80,18.97 70.92,18.97 70.92,0.19 0.6,0.19
GPS_EN  (via drill 0.33, 0.38, 0.51)
  Top 0.203: SJ4.1 53.13,5.64 SJ2.1 53.28,7.62 54.96,7.62 v54.96,7.32 | R3.2 61.21,13.26 61.67,13.26 61.73,13.19 | 61.53,10.48 61.36,10.52 60.29,10.52 C6.A | C5.1 58.16,9.75 57.86,9.75 57.75,9.73
  Top 0.254: 58.12,9.83 C5.1 | U2.58 68.38,7.5 | v69.14,12.84 70.32,12.84 70.79,13.31 U2.36 70.78,15.61 71.89,16.71 C8.1 74.39,16.71 L1.1 | U5.39 16.3,9.95 16.3,17.35
  Top 0.305: 61.73,13.19 62.03,12.89 v62.03,12.28
  Top 0.406: C5.1 58.97,10.48 C6.A | U2.58 67.62,8.34 v67.62,11.34 | U2.2 v62.03,12.28 62.03,10.98 61.53,10.48 | 57.75,9.73 54.41,13.07 SJ3.1 52,14.21 52,15 49,18 36,18 35.35,17.35 16.3,17.35
  Bottom 0.203: v54.96,7.32 54.96,9.6 56.18,10.82 56.18,13.56 56.33,13.56 56.79,14.02 60.29,14.02 61.97,12.34 v62.03,12.28
  Bottom 0.406: v67.62,11.34 v69.14,12.84 68.14,13.84 64.89,13.84 63.33,12.28 v62.03,12.28
MISO  (1 unrouted)
MOSI  (1 unrouted)
N$1
  Top 0.152: U1.20 38.26,13.41 C2.1
N$2
  Top 0.254: 37.76,6.42 U1.10
  Top 0.406: C4.1 37.76,6.42
N$3  (1 unrouted)
N$4
  Top 0.254: SJ2.2 54.73,8.45 58.54,4.63 R4.1
N$5
  Top 0.254: D1.1 56.44,5.79 56.95,5.27 R6.1
N$6
  Top 0.254: D1.2 53.66,3.48 53.14,4 SJ4.2
N$7  (1 unrouted)
N$8  (via drill 0.33)
  Top 0.61: v46,20 46,33 | 46,33 41,33 D2.A | Q1.D 52.2,35.2 50,33 46,33
  Bottom 0.61: S_WINCH.1 26.79,18.6 33.4,18.6 34.8,20 v46,20
N$9
  Top 0.61: S_RUD.1 35,24.73 35,33 35.15,33.15 D4.A 40.04,36.19 Q2.D
N$10  (1 unrouted)
N$11  (2 unrouted)
N$12  (1 unrouted)
  Top 0.203: C16.1 28.96,9.79 Y1.3
N$13
  Top 0.203: C18.2 14.91,2.3 15.75,3.13 15.75,3.83 U5.6
N$14  (1 unrouted)
N$15  (1 unrouted)
N$16
  Top 0.203: D6.2 6.89,6.01 7.14,5.76 F1.2
N$38  (1 unrouted)
NAV  (via drill 0.33, 0.51)  (1 unrouted)
  Top 0.152: v52.37,1.27 50.08,1.27 50.08,3.35 48.86,4.57
  Top 0.254: 61.25,6.24 61.55,6.54 61.55,7.65 v62.03,8.13 62.18,8.28 U2.7
  Bottom 0.152: v52.37,1.27 52.37,1.98 52.67,2.29 57.7,2.29 61.97,6.55 62.03,6.55
  Bottom 0.254: 62.03,6.54 62.03,6.55 v62.03,8.13
PPS  (via drill 0.38)
  Top 0.254: U2.40 67.59,12.89 v67.62,12.84
  Bottom 0.254: 60.76,2.73 62.35,2.73 64.89,5.27 64.89,11.42 65.55,12.09 66.87,12.09 v67.62,12.84
PSE_SEL
  Top 0.254: 62.67,7.48 62.03,6.87 62.03,6.06 61.39,5.43 58.54,5.43 55.84,8.13 55.84,10.51 54.09,12.26 SJ3.2 | 62.67,7.48 U2.8 | 62.67,7.48
PWR_EN  (1 unrouted)
  Top 0.203: 14.63,6.2 U5.1
RESET  (1 unrouted)
RFGND  (via drill 0.51)
  Top 0.254: U2.61 70.64,11.34 72.14,11.34 | U2.62 70.64,9.84 72.14,9.84
  Bottom 0.61: R7.2 74,12.28 74,12.25 71.75,12.25 71.75,12.75 72.4,12.75 72.4,12.85 72.35,12.85 72.35,11.85 74,11.85 74,12 71.75,12 71.75,7.3 72.19,7.3 v72.19,1.46
  other vias: 76,16.7 78.54,1.46 78.54,16.7 78.54,7.81 76,7.81
  pour Top: 71.56,17.97 71.56,0.19 79.81,0.19 79.81,17.97
  pour Bottom: 71.56,17.97 71.56,0.19 79.81,0.19 79.81,17.97
RSTN
  Top 0.254: C7.1 R3.1 61.7,14.49 63.11,13.08 U2.1
RUD_EN  (1 unrouted)
RUD_V  (1 unrouted)
RX0  (via drill 0.38, 0.51)
  Top 0.254: U2.42 65.99,12.99 v66.12,12.84 | R10.1 56.97,13.19 v56.95,13.21
  Bottom 0.254: v66.12,12.84 65.15,12.84 63.3,10.98 60.92,10.98 59.65,12.26 57.9,12.26 v56.95,13.21
RX1  (via drill 0.38)
  Top 0.254: 66.81,9.08 U2.52 v66.12,8.34
  Bottom 0.254: 66.12,5.55 v66.12,8.34
RX01  (1 unrouted)
SCK  (1 unrouted)
SCL  (via drill 0.33, 0.38)  (3 unrouted)
  Top 0.152: v67.61,1.98 50.39,1.98 50.39,3.5
  Top 0.254: v66.12,9.84 U2.46
  Bottom 0.152: v67.61,1.98 70.05,4.42 70.11,4.46
  Bottom 0.254: 70.11,4.46 70.11,8.83 69.59,9.37 66.6,9.37 v66.12,9.84
SDA  (via drill 0.38, 0.6)  (3 unrouted)
  Top 0.254: v66.12,11.34 U2.45
  Bottom 0.254: v66.12,11.34 67.36,10.1 69.85,10.1 70.92,9.03 70.92,2.73 69.19,1 54,1 53.6,0.6 51.65,0.6 50.5,1.75 v50.5,4.6
TX0  (1 unrouted)
TX1  (via drill 0.38)
  Top 0.254: v69.14,8.34 U2.57
  Bottom 0.254: 69.14,6.03 v69.14,8.34
UVCC  (2 unrouted)
  Top 0.203: 8.16,8.69 F1.1 8.02,8.83
  Top 0.254: 14.99,5.86 14.88,5.75 13.4,5.75 13.15,6 12.65,6 | 12.65,6 11,6 8.44,8.56 F1.1 | U5.7 16.3,3.68 16.3,2.4 16,2.1 16,1 14,1 12.65,2.35 12.65,6
V_BATT  (via drill 0.33)
  Top 0.61: C19.A 7,11.84 v7,10 6.48,9.48 D6.1 | D4.C D2.C v41,25 | v11.75,0.65 11.5,0.9 U4.1 | U4.3 v11.5,4.3
  Bottom 0.61: JP1.2 66.96,27.5 C13.1 59.54,33 C22.1 54.54,26.54 50,22 C21.1 42.54,23.46 v41,25 36,25 34,23 31,23 30.9,23.1 S_RUD.2 S_WINCH.2 20.1,23.1 v7,10 7,1 7.35,0.65 v11.75,0.65 11.75,4.05 v11.5,4.3
V_BATT_DIV  (2 unrouted)
VBAT  (via drill 0.33)
  Top 0.152: 53.13,2.74 53.14,2.73
  Top 0.254: U2.18 69.19,3.54 68.38,2.73 59.49,2.73 | 53.14,2.73 53.77,2.73 | 53.77,2.73 56.95,2.73 | 56.95,2.73 59.49,2.73 | 56.95,2.73 R6.2 | 53.77,2.73 53.79,2.75 | C10.1 59.49,3.51 59.49,2.73 | 53.13,2.74 53.13,3.35 51.91,3.35 51.75,3.52 51.75,4.9 51,5.65 v51,11 | C9.1 61.5,17 v52,17
  Bottom 0.254: v52,17 51,16 v51,11
WINCH_EN  (1 unrouted)
WIND_EN  (1 unrouted)
WN_V  (1 unrouted)
WS_1  (1 unrouted)
WS_2  (1 unrouted)

### Text on the board
Bottom: v13 | V2.1
tPlace: PSE | L H | BTS | F R | Micro | BAT | Pro | J1
bPlace: 5V | 3.3V
tNames: WS1 | WS2 | VCC | GND | GND | GND
bNames: TX | RX | VCC | PWR_EN | GND | V_BATT | GND